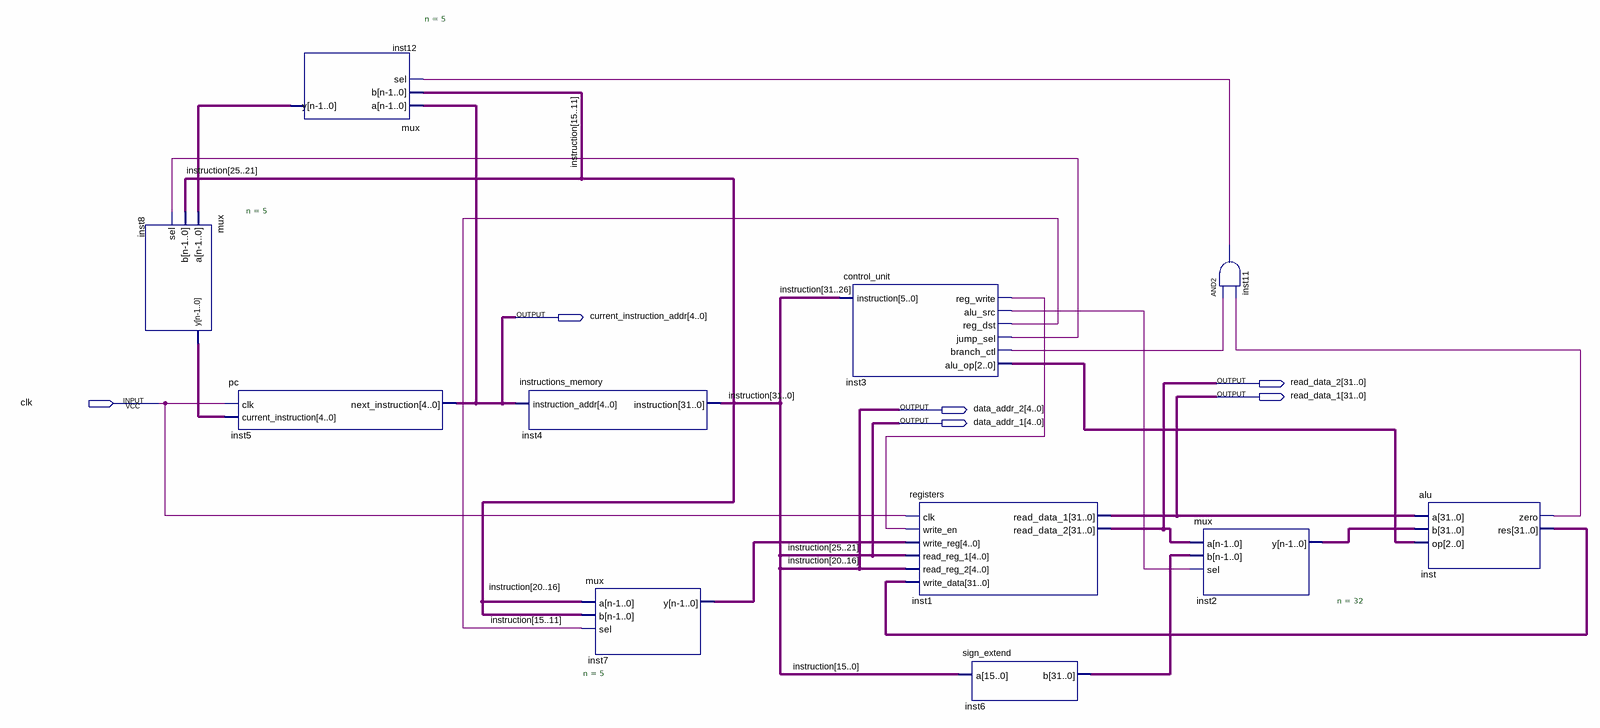
[diagram p0: schematic sheet]
// Quartus schematic main.bdf as structural Verilog: 11 symbols, 6 pins
module main (
  input  clk,
  output [4:0] current_instruction_addr,
  output [31:0] read_data_2,
  output [31:0] read_data_1,
  output [4:0] data_addr_2,
  output [4:0] data_addr_1
);

  wire inst3_alu_src, inst3_branch_ctl, inst3_jump_sel, inst3_reg_dst, inst3_reg_write, inst11_out, inst_zero;
  wire [2:0] inst3_alu_op;
  wire [4:0] inst7_y, inst8_y, inst12_y;
  wire [31:0] inst2_y, inst6_b, inst_res, instruction;

  mux #(.n(5)) inst8 (.a(inst12_y), .b(data_addr_1), .sel(inst3_jump_sel), .y(inst8_y));
  pc inst5 (.clk(clk), .current_instruction(inst8_y), .next_instruction(current_instruction_addr));
  mux #(.n(5)) inst12 (.a(current_instruction_addr), .b(instruction[15:11]), .sel(inst11_out), .y(inst12_y));
  instructions_memory inst4 (
    .instruction_addr(current_instruction_addr),
    .instruction({instruction[31:26], data_addr_1, data_addr_2, instruction[15:0]}));
  mux #(.n(5)) inst7 (.a(data_addr_2), .b(instruction[15:11]), .sel(inst3_reg_dst), .y(inst7_y));
  control_unit inst3 (
    .instruction(instruction[31:26]), .reg_write(inst3_reg_write), .alu_src(inst3_alu_src),
    .reg_dst(inst3_reg_dst), .jump_sel(inst3_jump_sel), .branch_ctl(inst3_branch_ctl), .alu_op(inst3_alu_op));
  registers inst1 (
    .clk(clk), .write_en(inst3_reg_write), .write_reg(inst7_y), .read_reg_1(data_addr_1),
    .read_reg_2(data_addr_2), .write_data(inst_res), .read_data_1(read_data_1), .read_data_2(read_data_2));
  sign_extend inst6 (.a(instruction[15:0]), .b(inst6_b));
  and inst11 (inst11_out, inst3_branch_ctl, inst_zero);
  mux #(.n(32)) inst2 (.a(read_data_2), .b(inst6_b), .sel(inst3_alu_src), .y(inst2_y));
  alu inst (.a(read_data_1), .b(inst2_y), .op(inst3_alu_op), .zero(inst_zero), .res(inst_res));

  // Other names for the same wires on the sheet: instruction[25:16] = {data_addr_1, data_addr_2}
endmodule
